# EAGLE design LSN50 v3.0 (EAGLE 9.6.2)
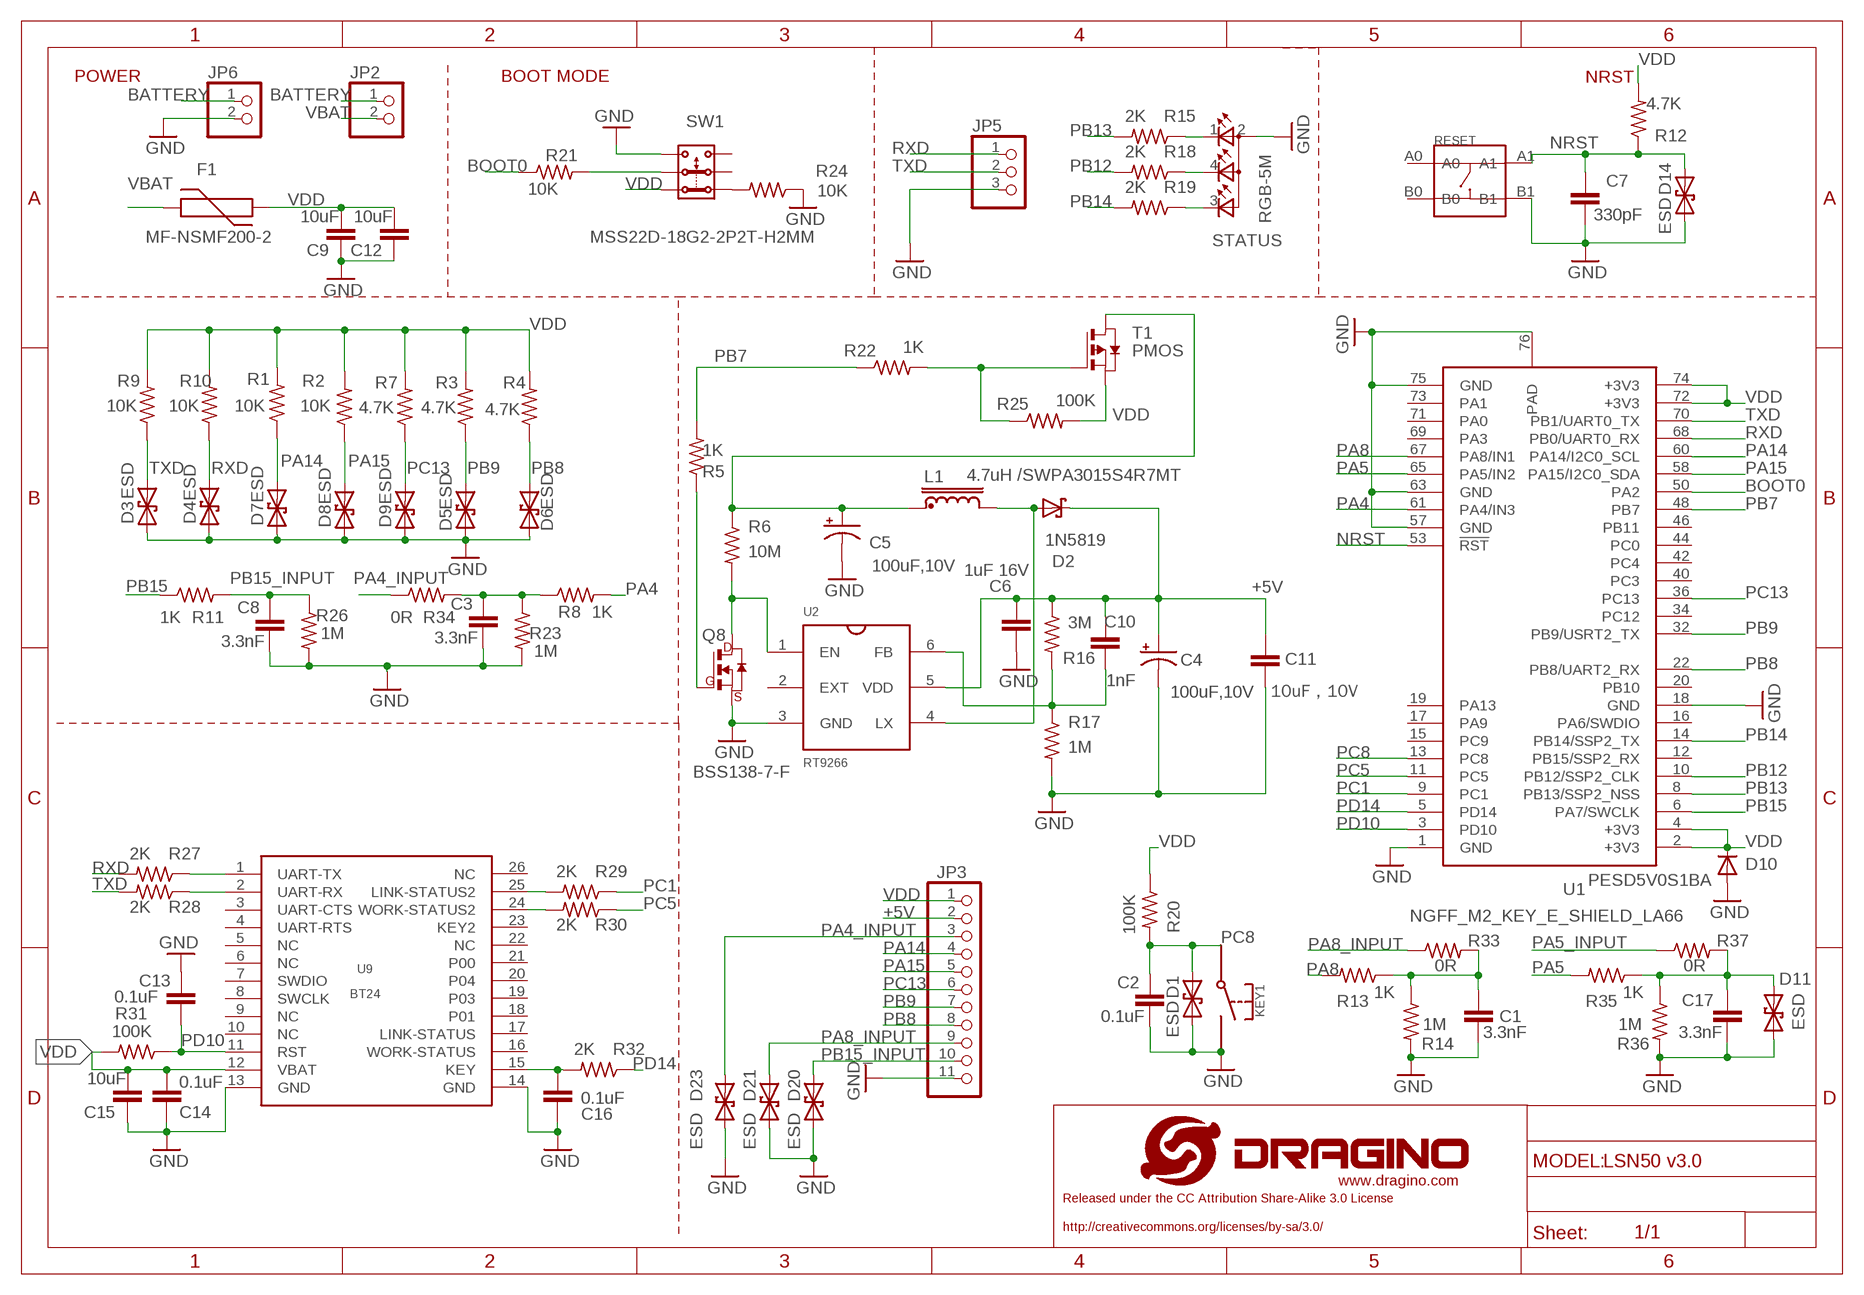
[diagram p0: schematic, sheet 1]

## Parts
C1  3.3nF  C-EUC0402  [C0402]
C2  0.1uF  C-EUC0402  [C0402]
C3  3.3nF  C-EUC0402  [C0402]
C4  100uF,10V  CPOL-USSMCB  [SMC_B]
C5  100uF,10V  CPOL-USSMCB  [SMC_B]
C6  1uF 16V  C-EUC0603  [C0603]
C7  330pF  C-EUC0402  [C0402]
C8  3.3nF  C-EUC0402  [C0402]
C9  10uF  C-EUC0805  [C0805]
C10  1nF  C-EUC0402  [C0402]
C11  10uF，10V  C-EUC0805  [C0805]
C12  10uF  C-EUC0805  [C0805]
C13  0.1uF  C-EUC0402  [C0402]
C14  0.1uF  C-EUC0402  [C0402]
C15  10uF  C-EUC0805  [C0805]
C16  0.1uF  C-EUC0402  [C0402]
C17  3.3nF  C-EUC0402  [C0402]
D1  ESD  ESD_TVS  [DFN1006]
D2  1N5819  SMF5.0AT1  [SOD123FL]
D3  ESD  ESD_TVS  [DFN1006]
D4  ESD  ESD_TVS  [DFN1006]
D5  ESD  ESD_TVS  [DFN1006]
D6  ESD  ESD_TVS  [DFN1006]
D7  ESD  ESD_TVS  [DFN1006]
D8  ESD  ESD_TVS  [DFN1006]
D9  ESD  ESD_TVS  [DFN1006]
D10  PESD5V0S1BA  DIODESOD323-R  [DIODE_SOD323-R]
D11  ESD  ESD_TVS  [DFN1006]
D14  ESD  ESD_TVS  [DFN1006]
D20  ESD  ESD_TVS  [DFN1006]
D21  ESD  ESD_TVS  [DFN1006]
D23  ESD  ESD_TVS  [DFN1006]
F1  MF-NSMF200-2  FUSE1206  [R1206]
JP2  PINHD-1X2  [1X02]
JP3  PINHD-1X11-MM  [KF350-11P]
JP5  PINHD-1X3  [1X03]
JP6  PINHD-1X2""  [XH2.54-2P]
KEY1  SWITCHDIL4  [SWITCH_6X6X19_DIL4]
L1  4.7uH /SWPA3015S4R7MT  INDUCTORSWPA3010S  [SWPA3010S]
Q8  BSS138-7-F  NMOSFET  [SOT-23]
R1  10K  R-US_R0402  [R0402]
R2  10K  R-US_R0402  [R0402]
R3  4.7K  R-US_R0402  [R0402]
R4  4.7K  R-US_R0402  [R0402]
R5  1K  R-US_R0402  [R0402]
R6  10M  R-US_R0402  [R0402]
R7  4.7K  R-US_R0402  [R0402]
R8  1K  R-US_R0402  [R0402]
R9  10K  R-US_R0402  [R0402]
R10  10K  R-US_R0402  [R0402]
R11  1K  R-US_R0402  [R0402]
R12  4.7K  R-US_R0402  [R0402]
R13  1K  R-US_R0402  [R0402]
R14  1M  R-US_R0402  [R0402]
R15  2K  R-US_R0402  [R0402]
R16  3M  R-US_R0402  [R0402]
R17  1M  R-US_R0402  [R0402]
R18  2K  R-US_R0402  [R0402]
R19  2K  R-US_R0402  [R0402]
R20  100K  R-US_R0402  [R0402]
R21  10K  R-US_R0402  [R0402]
R22  1K  R-US_R0402  [R0402]
R23  1M  R-US_R0402  [R0402]
R24  10K  R-US_R0402  [R0402]
R25  100K  R-US_R0402  [R0402]
R26  1M  R-US_R0402  [R0402]
R27  2K  R-US_R0402  [R0402]
R28  2K  R-US_R0402  [R0402]
R29  2K  R-US_R0402  [R0402]
R30  2K  R-US_R0402  [R0402]
R31  100K  R-US_R0402  [R0402]
R32  2K  R-US_R0402  [R0402]
R33  0R  R-US_R0402  [R0402]
R34  0R  R-US_R0402  [R0402]
R35  1K  R-US_R0402  [R0402]
R36  1M  R-US_R0402  [R0402]
R37  0R  R-US_R0402  [R0402]
RESET  轻触开关3*3*1.5四脚贴片开关  BUTTON-4P-3.3X3.3  [SW4-SMD-3.35X3.35X1.5MM]
STATUS  RGB-5M  [RGB]
SW1  MSS22D-18G2-2P2T-H2MM  [MSS22D-18G2-2P2T-H2MM-DIL]
T1  PMOS  PMOSSOT23  [SOT-23]
U1  NGFF_M2_KEY_E_SHIELD_LA66  [NGFF_M2_KEY_E_SHIELD]
U2  RT9266  [6/SOT-23]
U9  BT24  [BT24-SMD26]

## Nets
+5V: C4.+ C6.2 C10.2 C11.2 D2.C JP3.2 R16.1 U2.5(VDD)
BATTERY: JP2.1 JP6.1
BOOT0: R21.1 U1.50(PA2)
GND: C1.1 C2.1 C3.1 C4.- C5.- C6.1 C7.1 C8.1 C9.1 C11.1 C12.1 C13.2 C14.2 C15.1 C16.2 C17.1 D1.1 D3.1 D4.1 D5.1 D6.1 D7.1 D8.1 D9.1 D10.A D11.1 D14.1 D20.1 D21.1 D23.1 JP3.11 JP5.3 JP6.2 KEY1.2 Q8.2(S) R14.2 R17.2 R23.2 R24.1 R26.2 R36.2 RESET.B1 STATUS.2(A) SW1.1 U1.1(GND) U1.18(GND) U1.57(GND) U1.63(GND) U1.75(GND) U1.76(PAD) U2.3(GND) U9.13(GND) U9.14(GND)
N$3: R15.1 STATUS.1(CRED)
N$4: R24.2 SW1.4
N$5: Q8.3(G) R5.1
N$6: C10.1 R16.2 R17.1 U2.6(FB)
N$7: D2.A L1.P$2 U2.4(LX)
N$8: R18.1 STATUS.4(CBLUE)
N$9: Q8.1(D) R6.2 U2.1(EN)
N$10: R22.2 R25.1 T1.3(G)
N$11: R19.1 STATUS.3(CGREEN)
N$12: C1.2 R13.1 R14.1 R33.2
N$13: C5.+ L1.P$1 R6.1 T1.1(D)
N$14: R27.1 U9.1(UART-TX)
N$15: R28.1 U9.2(UART-RX)
N$16: C16.1 R32.2 U9.15(KEY)
N$17: C3.2 R8.1 R23.1 R34.2
N$18: R29.2 U9.25(LINK-STATUS2)
N$19: R30.2 U9.24(WORK-STATUS2)
N$20: C17.2 D11.2 R35.1 R36.1 R37.2
N$22: R21.2 SW1.2
NRST: C7.2 D14.2 R12.1 RESET.A1 U1.53(!RST)
PA4: R8.2 U1.61(PA4/IN3)
PA4_INPUT: D23.2 JP3.3 R34.1
PA5: R35.2 U1.65(PA5/IN2)
PA5_INPUT: R37.1
PA8: R13.2 U1.67(PA8/IN1)
PA8_INPUT: D21.2 JP3.9 R33.1
PA14: D7.2 JP3.4 R1.1 U1.60(PA14/I2C0_SCL)
PA15: D8.2 JP3.5 R2.1 U1.58(PA15/I2C0_SDA)
PB7: R5.2 R22.1 U1.48(PB7)
PB8: D6.2 JP3.8 R4.1 U1.22(PB8/UART2_RX)
PB9: D5.2 JP3.7 R3.1 U1.32(PB9/USRT2_TX)
PB12: R18.2 U1.10(PB12/SSP2_CLK)
PB13: R15.2 U1.8(PB13/SSP2_NSS)
PB14: R19.2 U1.14(PB14/SSP2_TX)
PB15: R11.1 U1.6(PA7/SWCLK)
PB15_INPUT: C8.2 D20.2 JP3.10 R11.2 R26.1
PC1: R29.1 U1.9(PC1)
PC5: R30.1 U1.11(PC5)
PC8: C2.2 D1.2 KEY1.1 R20.2 U1.13(PC8)
PC13: D9.2 JP3.6 R7.1 U1.36(PC13)
PD10: C13.1 R31.1 U1.3(PD10) U9.11(RST)
PD14: R32.1 U1.5(PD14)
RXD: D4.2 JP5.1 R10.1 R27.2 U1.68(PB0/UART0_RX)
TXD: D3.2 JP5.2 R9.1 R28.2 U1.70(PB1/UART0_TX)
VBAT: F1.2 JP2.2
VDD: C9.2 C12.2 C14.1 C15.2 D10.C F1.1 JP3.1 R1.2 R2.2 R3.2 R4.2 R7.2 R9.2 R10.2 R12.2 R20.1 R25.2 R31.2 SW1.3 T1.2(S) U1.2(+3V3) U1.4(+3V3) U1.72(+3V3) U1.74(+3V3) U9.12(VBAT)
Unconnected: RESET.A0 RESET.B0 SW1.5 SW1.6 U1.12(PB15/SSP2_RX) U1.15(PC9) U1.16(PA6/SWDIO) U1.17(PA9) U1.19(PA13) U1.20(PB10) U1.34(PC12) U1.40(PC3) U1.42(PC4) U1.44(PC0) U1.46(PB11) U1.69(PA3) U1.71(PA0) U1.73(PA1) U2.2(EXT) U9.3(UART-CTS) U9.4(UART-RTS) U9.5(NC) U9.6(NC) U9.7(SWDIO) U9.8(SWCLK) U9.9(NC) U9.10(NC) U9.16(WORK-STATUS) U9.17(LINK-STATUS) U9.18(P01) U9.19(P03) U9.20(P04) U9.21(P00) U9.22(NC) U9.23(KEY2) U9.26(NC)

## Notes on the sheet
- NRST
- POWER | BOOT MODE

## Library data of the parts
C1-C3 C6-C10 C12-C17 = dragino:C-EU: CAPACITOR, European symbol
C4 C5 = rcl:CPOL-US: POLARIZED CAPACITOR, American symbol
C11 = dragino-passive:C-EU: CAPACITOR, European symbol
D1 D3-D9 D11 D14 D20 D21 D23 = dragino:ESD_TVS: DIODE uni and bidirectional supressor diode
D2 = diode:SMF5.0AT1: 200 W Transient Voltage Suppressor Source: Data sheet <http://www.onsemi.com/pub_link/Collateral/SMF5.0AT1-D.PDF>
D10 = dragino:DIODE: DIODE
F1 = dragino:FUSE: FUSE 5 x 20 mm
JP2 JP6 = pinhead:PINHD-1X2: PIN HEADER
JP3 = pinhead:PINHD-1X11: PIN HEADER
JP5 = pinhead:PINHD-1X3: PIN HEADER
KEY1 = dragino:SWITCH
L1 = dragino:INDUCTOR: CHOKE U15
Q8 = dragino:NMOSFET: MOS FET; OC_FARNELL: unknown; OC_NEWARK: unknown
R1-R37 = dragino:R-US_: RESISTOR, American symbol
RESET = dragino:BUTTON-4P: SW4-6.0X6.0X5.0MM:311020024;SW4-8.0X8.0X9.0MM:311020028;SW4-SMD-6.0X6.0X5.0MM:311020004;SW4-SMD-3.35X3.35X1.5MM:311020030;SW4-SMD-5.2X5.2X2.5MM:311020046
STATUS = led:RGB-5M
SW1 = dragino:MSS22D-18G2-2P2T-H2MM
T1 = zetex:PMOSSOT23: MOS FET; OC_FARNELL: unknown; OC_NEWARK: unknown
U1 = dragino:NGFF_M2_KEY_E_SHIELD_LA66
U2 = dragino:RT9266
U9 = dragino:BT24

## Net classes
0 default: width 0.203 mm, drill 0.203 mm, clearance 0.203 mm
1 vcc: width 0.254 mm

## Board
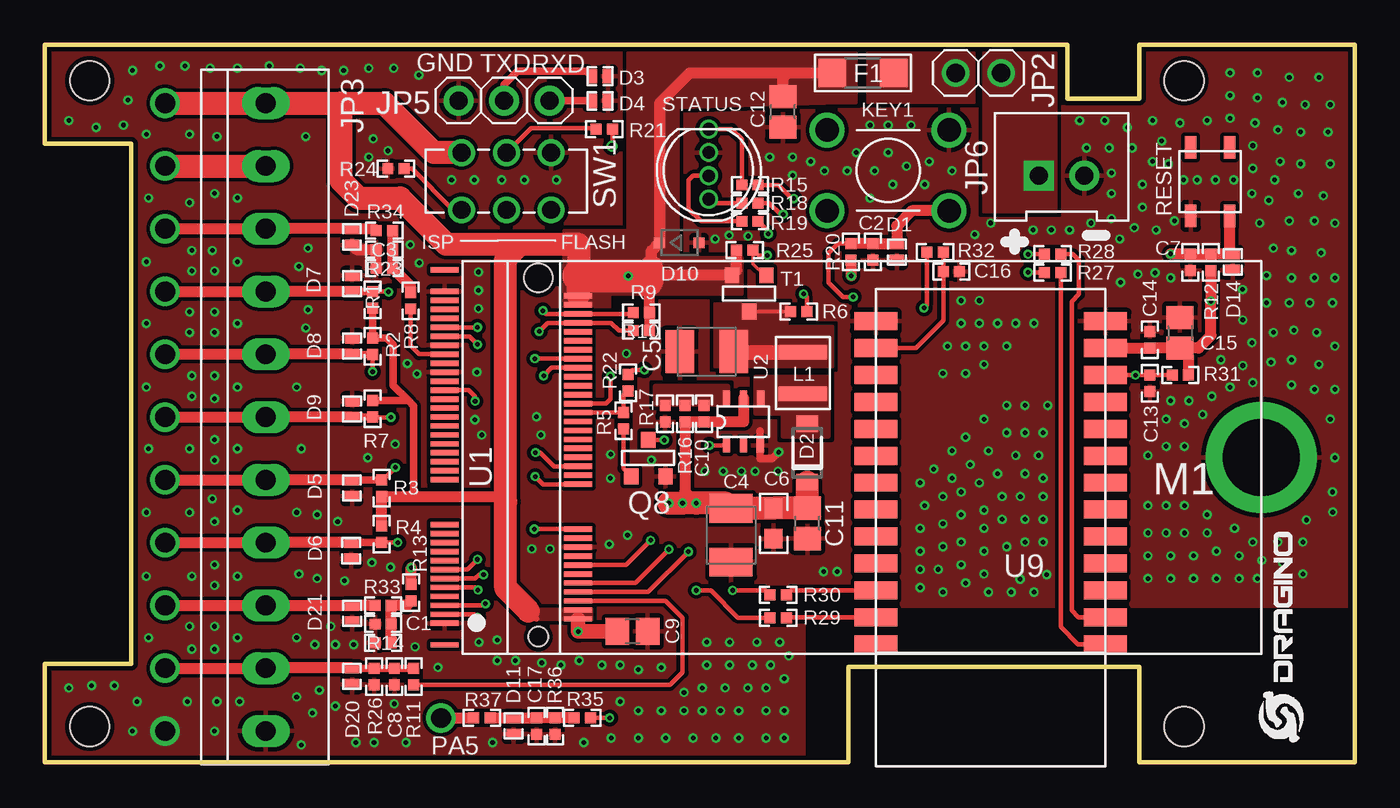
[diagram p1: board, top side]
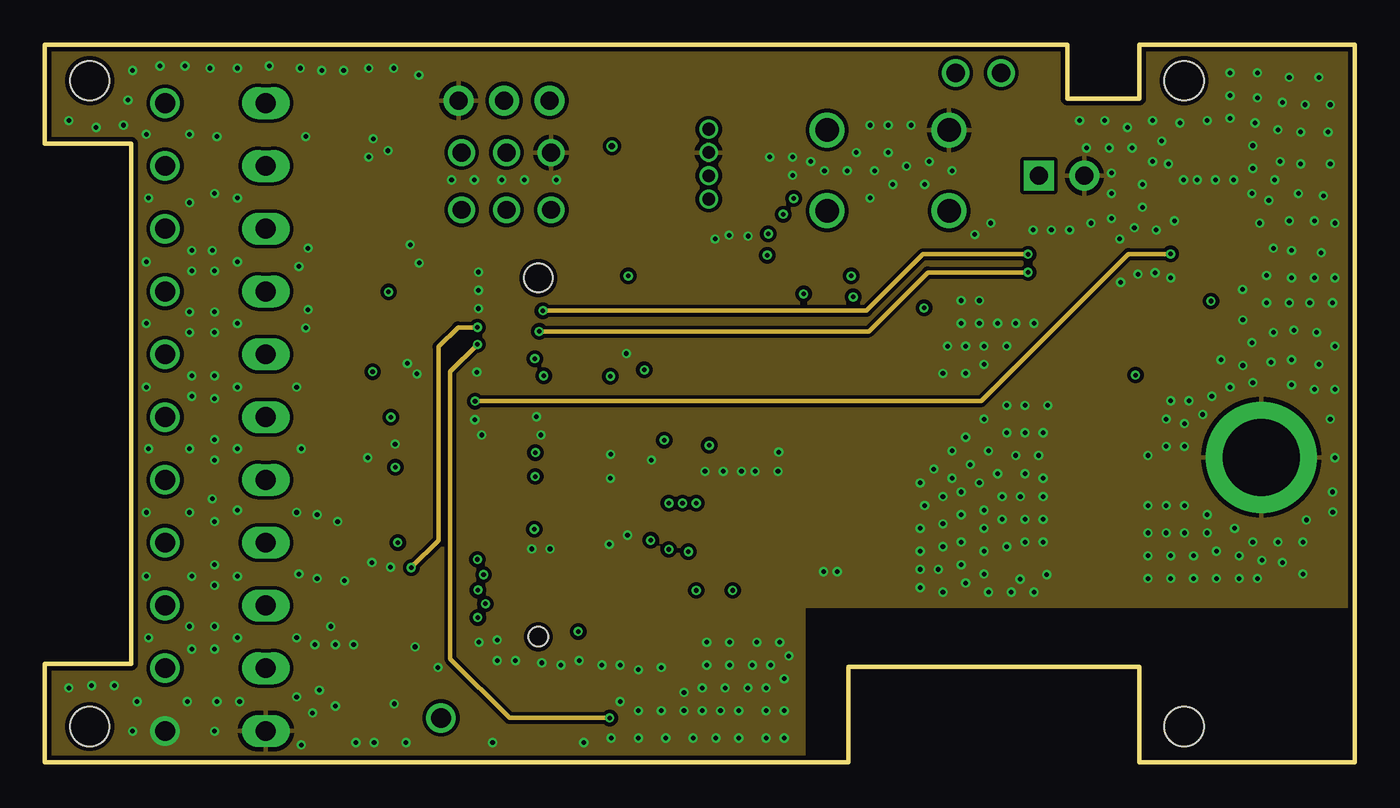
[diagram p2: board, inner layer Route2]
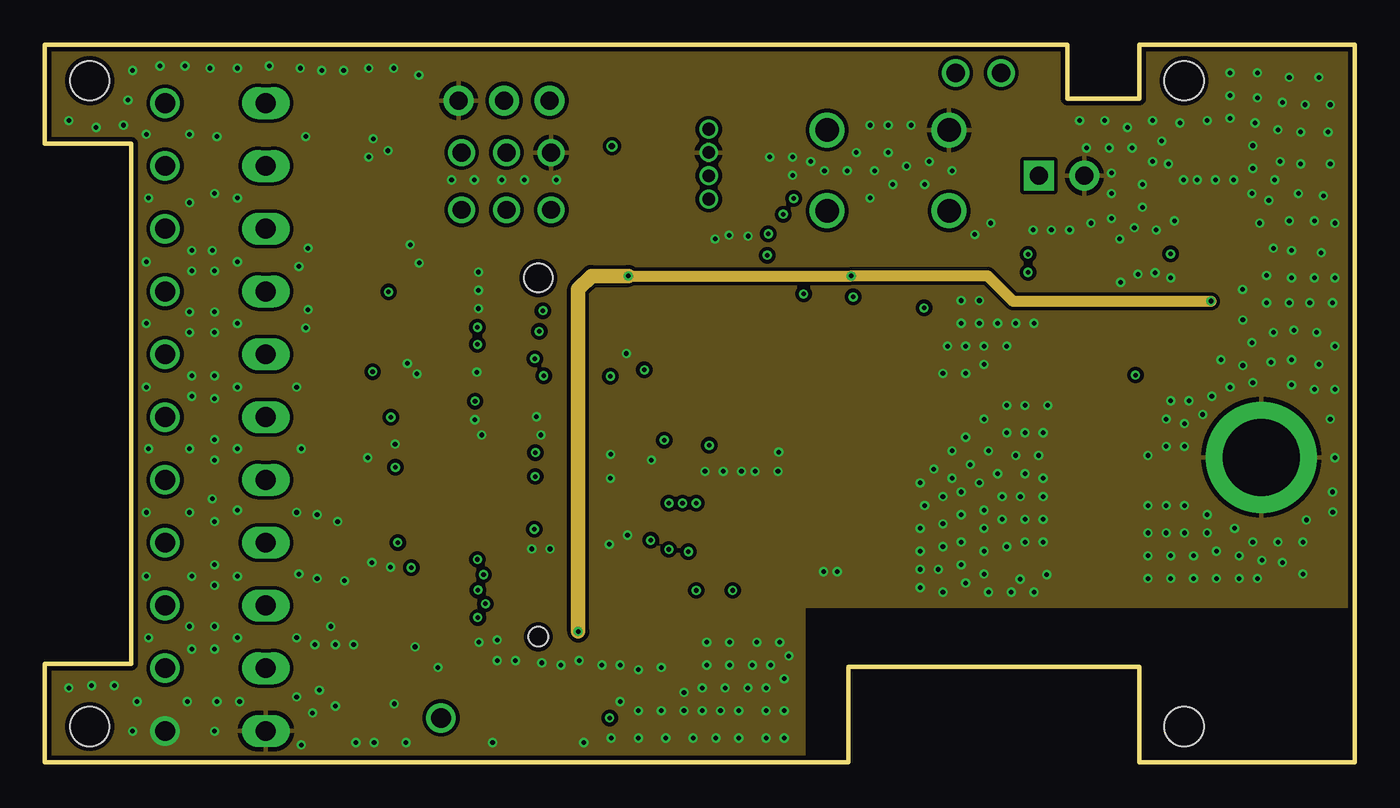
[diagram p3: board, inner layer Route15]
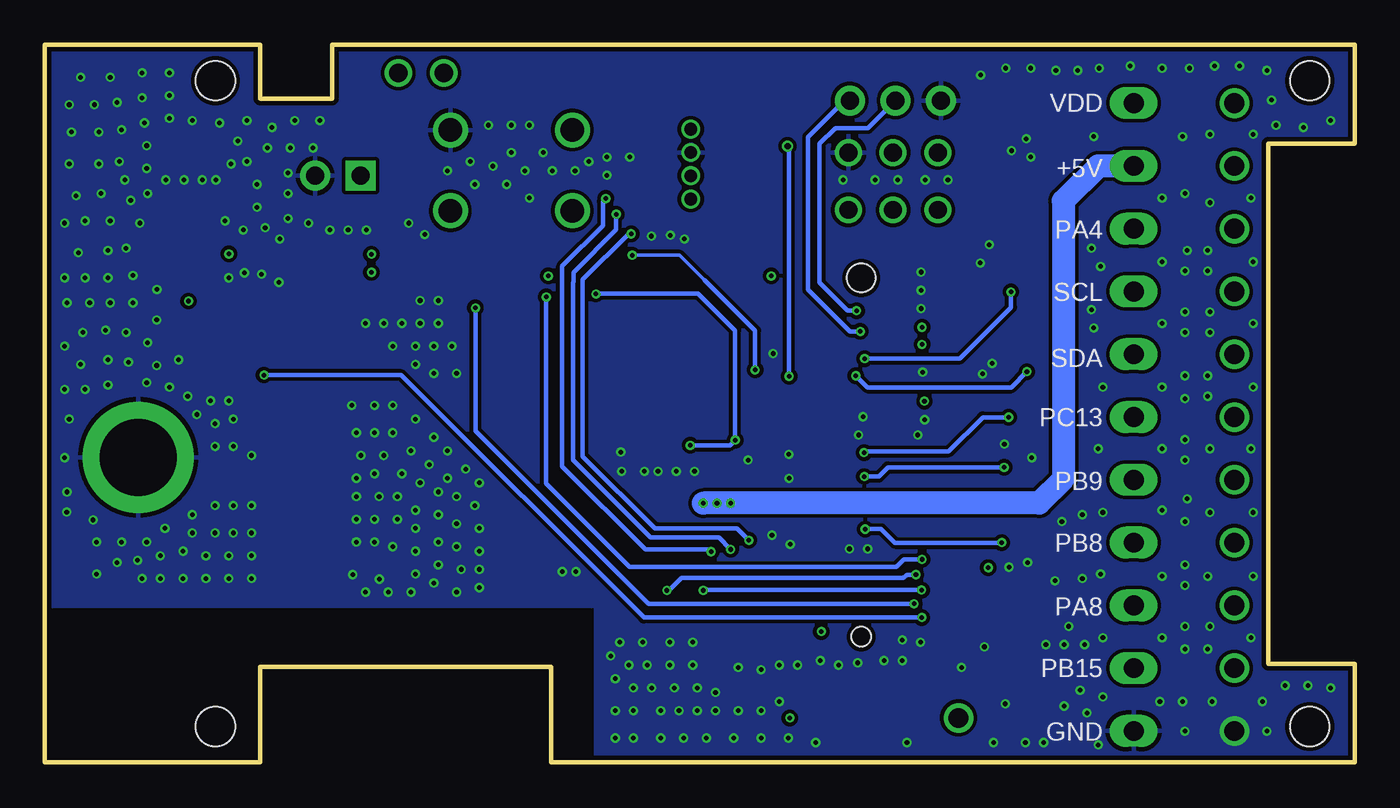
[diagram p4: board, bottom side, seen from below]

Size 73 x 40 mm. Coordinates in mm from the lower left corner, seen from the top.
Outline: 0,40 57,40 57,37 61,37 61,40 73,40 73,0 61,0 61,5.33 44.78,5.33 44.78,0 0,0 0,5.5 4.8,5.5 4.8,34.5 0,34.5 0,40
Copper layers (1*2+15*16): Top 0.035mm / dielectric 1.5mm / Route2 0.035mm / dielectric 0.15mm / Route15 0.035mm / dielectric 0.2mm / Bottom 0.035mm
Design rules "default *": minimum track width 6mil, minimum drill 10mil, track to track 8mil, track to pad 8mil, pad to pad 8mil, via to via 8mil, smd to smd 8mil, copper to edge 10mil, drill to drill 8mil, minimum pad ring 5mil, minimum via ring 5mil, stop-mask expansion 4mil, vias tented up to drill 30mil, thermal gap 10mil
Holes 2.2 mm at 2.5,2 2.5,38 63.5,38 63.5,2

### Footprints (pad centres in the part's own frame; a part is rotated, then mirrored left to right if it is on the bottom)
C0402 = smd 0.61 x 0.61: 1 -0.457,0; 2 0.457,0
SMC_B = smd 1.6 x 2.4: + -1.5,0; - 1.5,0
C0603 = smd 1.1 x 1: 1 -0.85,0; 2 0.85,0
C0805 = smd 1.3 x 1.5: 1 -0.85,0; 2 0.85,0
DFN1006 = smd 0.6 x 0.8: 1 -0.45,0; 2 0.45,0
SOD123FL = smd 0.91 x 1.22: A 1.625,0; C -1.625,0
DIODE_SOD323-R = smd 0.6 x 0.6: A 1.1,0; C -1.1,0
R1206 = smd 1.52 x 1.6: 1 -1.71,0; 2 1.71,0
1X02 = drill 1.016: 1 -1.27,0; 2 1.27,0
KF350-11P = drill 1.1 pad 1.778 long: 1 -8.75,0; 2 -5.25,0; 3 -1.75,0; 4 1.75,0; 5 5.25,0; 6 8.75,0; 7 12.25,0; 8 15.75,0; 9 19.25,0; 10 22.75,0; 11 26.25,0
1X03 = drill 1.016 pad 1.676: 1 -2.54,0; 2 0,0; 3 2.54,0
XH2.54-2P = drill 1 pad 1.676 square: 1 0,-1.27 | drill 1 pad 1.676: 2 0,1.27
SWITCH_6X6X19_DIL4 = drill 1.3: 1 -3.4,2.25; 2 -3.4,-2.25; 3 3.4,2.25; 4 3.4,-2.25
SWPA3010S = smd 0.8 x 2.7: P$1 -1.15,0; P$2 1.15,0
SOT-23 = smd 0.787 x 0.889: 1 0,-1.016; 2 -0.95,1.016; 3 0.95,1.016
R0402 = smd 0.61 x 0.61: 1 -0.457,0; 2 0.457,0
SW4-SMD-3.35X3.35X1.5MM = smd 1.27 x 0.635: A0 -1.905,1.079; A1 1.905,1.079; B0 -1.905,-1.079; B1 1.905,-1.079
RGB = drill 0.7 pad 1.016: 1 2.3,0; 2 1,0; 3 -0.3,0; 4 -1.6,0
MSS22D-18G2-2P2T-H2MM-DIL = drill 1: 1 -2.5,-1.6; 2 0,-1.6; 3 2.5,-1.6; 4 2.5,1.6; 5 0,1.6; 6 -2.5,1.6
SOT-23' = smd 0.787 x 0.889: 1 0.025,-1.016; 2 -0.94,1.016; 3 0.991,1.016
NGFF_M2_KEY_E_SHIELD = smd 0.3 x 1.55: 1 1.7,-0.775; 2 1.95,-8.225; 3 2.2,-0.775; 4 2.45,-8.225; 5 2.7,-0.775; 6 2.95,-8.225; 7 3.2,-0.775; 8 3.45,-8.225; 9 3.7,-0.775; 10 3.95,-8.225; 11 4.2,-0.775; 12 4.45,-8.225; 13 4.7,-0.775; 14 4.95,-8.225; 15 5.2,-0.775; 16 5.45,-8.225; 17 5.7,-0.775; 18 5.95,-8.225; 19 6.2,-0.775; 20 6.45,-8.225; 21 6.7,-0.775; 22 6.95,-8.225; 23 7.2,-0.775; 32 9.45,-8.225; 33 9.7,-0.775; 34 9.95,-8.225; 35 10.2,-0.775; 36 10.45,-8.225; 37 10.7,-0.775; 38 10.95,-8.225; 39 11.2,-0.775; 40 11.45,-8.225; 41 11.7,-0.775; 42 11.95,-8.225; 43 12.2,-0.775; 44 12.45,-8.225; 45 12.7,-0.775; 46 12.95,-8.225; 47 13.2,-0.775; 48 13.45,-8.225; 49 13.7,-0.775; 50 13.95,-8.225; 51 14.2,-0.775; 52 14.45,-8.225; 53 14.7,-0.775; 54 14.95,-8.225; 55 15.2,-0.775; 56 15.45,-8.225; 57 15.7,-0.775; 58 15.95,-8.225; 59 16.2,-0.775; 60 16.45,-8.225; 61 16.7,-0.775; 62 16.95,-8.225; 63 17.2,-0.775; 64 17.45,-8.225; 65 17.7,-0.775; 66 17.95,-8.225; 67 18.2,-0.775; 68 18.45,-8.225; 69 18.7,-0.775; 70 18.95,-8.225; 71 19.2,-0.775; 72 19.45,-8.225; 73 19.7,-0.775; 74 19.95,-8.225; 75 20.2,-0.775; X 0.5,-0.775; Y 21.4,-0.775 | drill 4.3 pad 6.2: 76 10.95,-46.3 | hole 1.6: 20.95,-6 | hole 1.1: 0.95,-6
6/SOT-23 = smd 0.406 x 0.813: 1 -0.965,-1.372; 2 -0.015,-1.372; 3 0.911,-1.372; 4 0.937,1.27; 5 -0.015,1.27; 6 -0.965,1.27
BT24-SMD26 = smd 2.4 x 1: 1 -6.4,6.5; 2 -6.4,5; 3 -6.4,3.5; 4 -6.4,2; 5 -6.4,0.5; 6 -6.4,-1; 7 -6.4,-2.5; 8 -6.4,-4; 9 -6.4,-5.5; 10 -6.4,-7; 11 -6.4,-8.5; 12 -6.4,-10; 13 -6.4,-11.5; 14 6.4,-11.5; 15 6.4,-10; 16 6.4,-8.5; 17 6.4,-7; 18 6.4,-5.5; 19 6.4,-4; 20 6.4,-2.5; 21 6.4,-1; 22 6.4,0.5; 23 6.4,2; 24 6.4,3.5; 25 6.4,5; 26 6.4,6.5

### Placement (x,y rotation side)
C1  18.85,7.71 0 top
C2  46.14,28.45 90 top
C3  18.92,28.6 0 top
C4  38.25,12.66 270 top
C5  36.89,22.9 180 top
C6  40.61,13.32 90 top
C7  63.84,27.88 90 top
C8  19.48,4.77 90 top
C9  32.75,7.3 180 top
C10  36.74,19.43 270 top
C11  42.49,13.32 90 top
C12  41.13,36.26 90 top
C13  61.59,21.13 270 top
C14  61.59,23.55 90 top
C15  63.27,23.94 270 top
C16  50.53,27.37 0 top
C17  27.4,2.03 90 top
D1  47.48,28.45 90 top
D2  42.49,17.25 90 top
D3  30.93,38.25 180 top
D4  30.93,36.87 180 top
D5  17.11,15.29 90 top
D6  17.08,11.8 90 top
D7  17.13,26.69 270 top
D8  17.13,23.2 270 top
D9  17.13,19.7 270 top
D10  35.36,28.97 0 top
D11  26.13,2.03 90 top
D14  66.2,27.9 90 top
D20  17.11,4.81 90 top
D21  17.12,8.3 90 top
D23  17.11,29.3 90 top
F1  45.6,38.43 0 top
JP2  52.03,38.43 180 top
JP3  12.31,28 270 top
JP5  25.59,36.89 180 top
JP6  56.67,32.7 270 top
KEY1  47,33 180 top
L1  42.25,21.71 270 top
Q8  33.63,16.97 180 top
R1  18.28,25.78 270 top
R2  18.28,23.2 90 top
R3  18.77,15.29 270 top
R4  18.78,12.71 90 top
R5  32.24,19.05 90 top
R6  42.01,25.12 0 top
R7  18.27,19.71 90 top
R8  20.38,25.74 270 top
R9  33.25,25.08 0 top
R10  33.25,24.06 0 top
R11  20.55,4.77 90 top
R12  64.99,27.88 270 top
R13  20.42,9.46 90 top
R14  18.85,6.67 180 top
R15  39.3,32.19 0 top
R16  35.67,19.43 90 top
R17  34.58,19.43 270 top
R18  39.3,31.18 0 top
R19  39.3,30.16 0 top
R20  44.94,28.45 90 top
R21  31.18,35.31 180 top
R22  32.5,21.17 90 top
R23  18.92,27.56 180 top
R24  19.57,33.09 0 top
R25  39.01,28.55 180 top
R26  18.36,4.77 270 top
R27  56.16,27.32 180 top
R28  56.16,28.33 180 top
R29  40.87,8.06 0 top
R30  40.87,9.33 0 top
R31  63.28,21.58 0 top
R32  49.61,28.46 0 top
R33  18.85,8.75 0 top
R34  18.92,29.65 0 top
R35  29.95,2.47 0 top
R36  28.43,2.03 270 top
R37  24.36,2.47 0 top
RESET  64.94,32.38 270 top
STATUS  37,33 90 top
SW1  25.72,32.4 180 top
T1  PMOS  [SOT-23']  39.23,26.14 0 top
U1  21.5,6.05 90 top
U2  38.96,19.04 0 top
U9  52.71,13.09 180 top
U$2  LOGO-NEW  [LOGO-SILK-NEW]  70.13,1.12 90 top

### Tracks (layer width: path | path; a pad name or v marks a point on that pad's centre or on a via)
+5V  (via drill 0.25, 1.1)
  Top 0.61: U2.5 38.94,18.98 C10.2 R16.1 | R16.1 | R16.1 35.67,15.08 v36.3,14.45
  Top 1.27: v6.7,33.25 JP3.2 | v34.78,14.45 v35.54,14.45 v36.3,14.45 37.96,14.45 C4.+ C6.2 C11.2 D2.C
  Bottom 1.27: JP3.2 14.29,33.25 16.24,31.3 16.24,15.81 17.59,14.45 v36.3,14.45
BATTERY
  pour Top (no thermals): 52.3,39.56 52.3,30.67 56.37,30.67 56.37,39.56
BOOT0  (via drill 0.25, 0.35)
  Top 0.254: v31.52,21.52 31.52,20.25 31.27,20 U1.50 | R21.1 31.63,34.38 v31.6,34.35
  Bottom 0.254: v31.6,34.35 31.52,34.27 v31.52,21.52
GND  (via drill 0.25, 1.1)
  Top 0.406: v40.9,17.3 40.56,16.95 39.86,16.95 39.87,16.96 U2.3 39.87,18.46 39.86,18.48
  Top 0.61: R23.2 C3.1 17.36,28.6 D23.1
  other vias: 31.52,15.84 31.54,17.17 32.41,22.79 67.27,23.39 66.77,24.66 66.77,22.12 24.35,18.25 6.7,1.75 18.3,34.76 18.05,33.74 19.13,34.1 20.84,38.32 19.45,38.7 18.05,38.7 16.65,38.57 14.24,38.7 45.99,31.46 52.72,30.06 57.67,35.78 59.07,35.78 61.74,35.78 58.05,34.25 59.32,34.25 60.59,34.25 66.75,26.37 59.45,32.86 59.45,31.71 59.45,30.32 60.72,29.81 19.52,17.74 18,16.98 58.31,30.06 61.74,33.49 62.24,34.63 60.34,35.4 63.26,35.65 62.63,33.36 64.78,35.78 66.05,35.9 66.05,37.17 66.05,38.44 67.58,38.44 67.58,37.05 67.45,35.65 67.32,34.38 67.32,33.11 69.36,38.19 71.01,38.19 68.98,36.79 70.25,36.67 71.64,36.67 68.72,35.27 69.99,35.14 71.52,35.14 68.85,33.49 69.99,33.36 71.64,33.36 68.21,31.33 69.86,31.71 71.26,31.59 67.71,30.06 69.36,30.19 70.75,30.19 71.9,30.06 68.47,28.66 69.48,28.54 71.13,28.41 68.09,27.14 69.48,27.01 70.75,27.01 71.9,27.01 68.09,25.62 69.36,25.62 70.5,25.62 71.77,25.62 68.47,23.97 69.61,24.09 70.88,23.97 71.9,23.2 68.34,22.31 69.48,22.44 71.01,22.19 69.48,21.04 70.75,20.79 71.9,20.79 71.64,19.14 68.72,12.28 70.12,12.28 68.98,11.14 71.78,13.96 70.31,13.51 71.77,15.08 71.9,16.98 21.91,5.29 17.21,6.56 16.19,6.56 20.64,6.44 16.19,3.14 15.3,4.03 14.03,3.64 14.92,2.75 14.29,0.98 10.86,3.39 9.59,3.39 7.94,3.39 9.46,1.74 5.14,3.39 4.89,1.74 3.87,4.28 1.33,4.15 9.46,6.31 9.46,7.58 8.06,7.58 8.19,6.31 10.73,6.95 14.03,6.95 15.05,6.56 15.94,7.58 9.46,9.87 9.46,11.01 8.19,10.38 10.73,10.38 14.16,10.5 15.18,10.25 16.7,10.12 18.22,11.14 25.21,6.82 24.19,6.69 5.78,6.95 5.65,10.38 5.65,13.93 8.06,13.93 9.46,13.42 9.33,14.69 10.73,14.06 14.03,13.93 15.18,13.8 16.32,13.42 9.46,16.85 9.46,18 8.06,17.49 5.78,17.49 10.73,17.49 14.29,17.49 5.65,20.92 8.19,20.41 8.19,21.55 9.46,21.55 9.46,20.28 10.73,20.92 14.03,20.92 5.65,24.47 8.06,25.11 8.06,23.96 9.46,25.11 9.46,23.96 10.73,24.47 14.67,25.23 14.54,24.22 8.19,28.54 8.19,27.39 5.65,27.9 9.33,28.54 9.46,27.39 10.73,27.9 14.67,28.66 14.16,27.65 9.46,31.71 8.06,31.2 10.73,31.46 5.78,31.46 5.65,35.01 8.06,35.01 9.59,34.89 14.54,34.89 4.38,35.52 2.86,35.39 1.33,35.77 4.63,36.92 4.89,38.57 6.41,38.82 7.81,38.82 9.21,38.7 10.73,38.7 12.51,38.82 15.43,38.57 33.08,5.17 34.35,5.29 2.6,4.28 24.17,27.33 37.35,29.17 39.19,29.34 38.14,29.39 32.07,5.42 31.05,5.42 29.78,5.68 28.76,5.42 27.7,5.55 26.22,5.68 25.21,5.68 33.08,2.88 34.35,2.88 35.62,2.88 36.64,2.88 37.65,2.88 38.67,2.88 40.19,2.88 41.21,2.88 31.56,1.36 33.08,1.36 34.61,1.36 36.13,1.36 37.4,1.36 38.67,1.36 40.19,1.36 41.21,1.36 36.64,4.15 36.89,5.42 36.89,6.69 38.16,6.69 39.69,6.69 40.96,6.69 38.16,5.42 37.91,4.15 39.18,4.15 39.43,5.42 40.45,5.42 40.19,4.15 41.21,4.66 41.46,5.93 35.62,3.9 20.36,28.86 20.87,27.84 24.17,26.32 24.17,25.3 23.97,19.1 27.4,19.27 27.65,18.25 32.48,12.66 31.46,12.15 28.16,11.9 27.14,11.9 19.27,10.88 36.79,16.22 37.81,16.22 38.83,16.22 39.59,16.22 43.4,10.63 44.16,10.63 57.11,29.68 56.1,29.68 55.08,29.68 61.18,32.22 61.18,30.95 61.94,29.68 59.91,29.17 62.96,30.19 68.54,32.47 67.27,31.71 66.26,32.47 65.24,32.47 64.23,32.47 63.46,32.47 62.75,27.01 61.88,27.29 60.92,27.22 59.96,26.76 51.07,25.74 52.08,25.74 51.07,24.47 52.08,24.47 53.1,24.47 54.12,24.47 55.13,24.47 50.31,23.2 51.32,23.2 52.34,23.2 53.61,23.2 50.05,21.68 51.32,21.68 52.34,22.19 65.55,22.44 62.75,20.16 63.77,20.16 65.04,20.41 67.32,21.17 66.05,20.92 62.5,19.14 63.51,18.89 64.53,19.39 62.5,17.62 63.51,17.62 61.48,17.11 61.48,14.31 62.5,14.31 63.51,14.31 64.78,13.81 61.48,12.79 62.5,12.79 63.51,12.79 64.78,12.79 66.31,13.04 67.32,12.28 61.48,11.52 61.48,10.25 62.75,11.52 62.75,10.25 64.02,11.52 64.02,10.25 65.29,11.77 65.29,10.25 66.56,11.52 66.56,10.25 67.58,10.25 67.83,11.27 70.12,10.5 55.89,19.9 54.62,19.9 53.61,19.9 52.34,19.14 51.32,18.12 50.56,17.36 49.54,16.35 48.78,15.58 53.61,18.38 54.62,18.38 55.64,18.38 52.59,17.36 54.12,17.11 55.39,17.11 51.58,16.6 53.1,16.09 54.62,16.09 55.64,15.84 50.56,15.84 52.08,15.58 50.05,14.82 49.04,14.31 48.78,13.04 48.78,11.77 48.78,10.76 48.78,9.74 50.05,13.3 50.05,12.03 49.8,10.76 50.05,9.49 51.32,10 51.07,11.01 51.07,12.28 51.07,13.81 51.07,15.08 52.34,14.06 52.34,13.04 52.34,11.77 52.34,10.5 52.59,9.49 53.86,9.49 55.13,9.49 55.84,10.47 54.36,10.21 53.61,12.03 54.62,12.28 55.64,12.28 55.64,13.55 55.64,14.82 54.37,14.82 53.35,14.82 53.35,13.55 54.62,13.55 40.4,33.74 41.67,33.74 42.69,33.49 41.67,32.73 43.45,32.98 44.72,32.98 45.23,34 46.24,32.98 47.26,32.22 48.02,33.24 47,34 48.27,35.52 47,35.52 45.99,35.52 49.29,33.49 49.04,32.22 50.56,32.98 51.83,29.43 40.86,16.22 30.03,1.1 32.07,3.39 24.95,1.1 20.13,1.1 18.35,1.1 17.33,1.1 19.47,3.26 23.94,32.47 25.46,32.47 22.67,32.47 26.73,32.47 28.51,32.47 33.81,16.85 24.08,21.75 20.2,22.24 20.74,21.65
  pour Top (rank 2): -1.67,40.95 73.77,40.95 73.77,8.72 42.27,8.72 42.27,-1.34 -1.67,-1.34
  pour Bottom (rank 2): -1.67,40.95 73.77,40.95 73.77,8.72 42.27,8.72 42.27,4.63 42.27,-1.34 -1.04,-1.34 -1.67,-1.34
  pour Route15 (rank 2): -1.67,40.95 73.77,40.95 73.77,8.72 42.27,8.72 42.27,4.63 42.27,-1.34 -1.04,-1.34 -1.67,-1.34
  pour Route2 (rank 2): -1.67,40.95 73.77,40.95 73.77,8.72 42.27,8.72 42.27,4.63 42.27,-1.34 -1.04,-1.34 -1.67,-1.34
N$3
  Top 0.254: STATUS.1 38.27,35.3 38.84,34.73 R15.1
N$4
  Top 0.254: R24.2 20.48,33.09 22.77,30.8 SW1.4
N$5
  Top 0.254: R5.1 32.24,16.39 Q8.3
N$6
  pour Top (no thermals): 38.08,20.97 38.08,19.95 34.02,19.95 34.02,20.97
N$7
  pour Top (no thermals): 43.67,21.48 43.67,18.18 41.13,18.18 41.13,19.45 39.6,19.45 39.6,21.48
N$8
  Top 0.254: STATUS.4 37.22,31.18 R18.1
N$9  (via drill 0.25)
  Top 0.254: U2.1 v37.03,17.67 | Q8.1 34.51,17.98 v34.52,17.97 | R6.2 42.47,25.94 v42.29,26.11
  Bottom 0.254: v37.03,17.67 34.82,17.67 v34.52,17.97 34.52,24.06 36.6,26.14 42.27,26.14 v42.29,26.11
N$10  (via drill 0.25)
  Top 0.203: T1.3 40.11,27.15 39.47,27.79 R25.1 39.75,28.27 v40.26,28.27
  Top 0.254: v33.41,21.88 32.75,21.88 R22.2
  Bottom 0.203: 36.23,26.88 37.62,28.27 v40.26,28.27
  Bottom 0.254: v33.41,21.88 33.41,24.06 36.23,26.88
N$11
  Top 0.254: STATUS.3 36.14,32.7 35.88,32.45 35.88,30.83 36.56,30.16 R19.1
N$12
  Top 0.61: R14.1 C1.2 R33.2 20.17,8.75 R13.1
N$13
  Top 0.203: R6.1 T1.1
  Top 0.813: L1.P$1 38.39,22.86 C5.+
  pour Top (no thermals): 37.32,25.59 37.32,22.03 43.92,22.03 43.92,24.32 42.14,24.32 41.38,24.32 41.38,25.33 41.38,25.59
N$14
  Top 0.254: R27.1 56.62,7.55 57.59,6.59 U9.1
N$15
  Top 0.254: U9.2 57.61,8.09 57.23,8.47 57.23,25.69 57.64,26.1 57.64,28 57.31,28.33 R28.1
N$16
  Top 0.254: U9.15 48.54,23.09 50.07,24.62 C16.1 R32.2
N$17
  Top 0.61: R34.2 C3.2 R23.1 20.38,26.55 R8.1
N$18
  Top 0.203: R29.2 41.36,8.09
  Top 0.254: 41.36,8.09 U9.25
N$19
  Top 0.254: R30.2 41.59,9.59 U9.24
N$20
  Top 0.61: R37.2 D11.2 C17.2 | C17.2 | C17.2 R36.1 28.44,2.47 R35.1
N$22
  Top 0.254: SW1.2 27.09,35.37 30.66,35.37 R21.2
NRST  (via drill 0.25)
  Top 0.254: U1.53 23.61,20.75 23.98,20.39 v23.98,20.14
  Top 0.61: D14.2 | D14.2 R12.1 C7.2 v62.74,28.34 | RESET.A1 66.02,28.51 D14.2
  Route2 0.254: v23.98,20.14 52.19,20.14 60.39,28.34 v62.74,28.34
PA4
  Top 0.254: R8.2 20.38,23.23 20.85,22.75 U1.61
PA4_INPUT  (via drill 1.1)
  Top 0.61: v6.7,29.75 JP3.3 D23.2 18.36,29.75 R34.1
PA5  (via drill 0.25)
  Top 0.254: U1.65 23.66,23.75 v24.11,23.3 | R35.2 v31.48,2.47
  Route2 0.254: v24.11,23.3 22.59,21.78 22.59,5.78 25.89,2.47 v31.48,2.47
PA5_INPUT  (via drill 1.1)
  Top 0.61: v22.08,2.47 R37.1
PA8  (via drill 0.25)
  Top 0.254: U1.67 v24.11,24.25
  Top 0.61: R13.2 v20.42,10.86
  Route2 0.254: v20.42,10.86 21.94,12.38 21.94,23.17 23.03,24.25 v24.11,24.25
PA8_INPUT  (via drill 1.1)
  Top 0.406: D21.2
  Top 0.61: R33.1 D21.2 JP3.9 v6.7,8.75
PA14  (via drill 0.25, 1.1)
  Top 0.254: R1.1 19.14,26.24 v19.16,26.22 | U1.60 v27.31,22.5 | v27.31,22.5
  Top 0.406: R1.1 D7.2
  Top 0.61: v6.7,26.25 JP3.4 D7.2
  Bottom 0.254: v27.31,22.5 27.29,22.52 22,22.52 19.16,25.36 v19.16,26.22
PA15  (via drill 0.25, 1.1)
  Top 0.254: R2.1 v18.28,21.79 v18.27,21.78 | U1.58 28.25,22 v27.8,21.55
  Top 0.406: R2.1 D8.2
  Top 0.61: v6.7,22.75 JP3.5 | D8.2 JP3.5 | JP3.5
  Bottom 0.254: v27.8,21.55 27.15,20.9 19.14,20.9 v18.27,21.78
PB7
  Top 0.254: R22.1 32.24,20.46 R5.2 U1.48
PB8  (via drill 0.25, 1.1)
  Top 0.254: v19.66,12.25 R4.1 | U1.22 v27.28,13 | v27.28,13
  Top 0.406: R4.1 D6.2
  Top 0.61: v6.7,12.25 JP3.8 D6.2
  Bottom 0.254: v27.28,13 26.39,13 25.63,12.24 19.68,12.24 v19.66,12.25
PB9  (via drill 0.25, 1.1)
  Top 0.254: R3.1 18.84,15.75 v19.54,16.44 | U1.32 27.77,15.5 v27.33,15.94
  Top 0.406: R3.1 D5.2
  Top 0.61: v6.7,15.75 JP3.7 D5.2
  Bottom 0.254: v27.33,15.94 26.52,15.94 26.02,16.44 v19.54,16.44
PB12  (via drill 0.25)
  Top 0.254: R18.2 40.37,31.18 40.99,30.55 v41.15,30.55 | U1.10 32.91,10 v34.78,11.87
  Bottom 0.254: v34.78,11.87 35.44,12.53 39.25,12.53 43.57,16.85 43.57,26.76 43.54,26.78 43.54,27.32 41.15,29.7 v41.15,30.55
PB13  (via drill 0.25)
  Top 0.254: R15.2 40.87,32.19 41.64,31.43 v41.74,31.43 | U1.8 33.63,9.5 v35.87,11.74
  Bottom 0.254: v35.87,11.74 36,11.87 39.53,11.87 44.16,16.51 44.16,27.66 41.9,29.92 41.9,31.27 v41.74,31.43
PB14  (via drill 0.25)
  Top 0.254: R19.2 40.33,29.59 v40.33,29.46 | U1.14 32.38,11 v33.76,12.38
  Bottom 0.254: v33.76,12.38 34.44,13.05 39.01,13.05 43.02,17.07 43.02,26.91 40.47,29.46 v40.33,29.46
PB15
  Top 0.254: U1.6 34.6,9 35.54,8.06 35.54,5.01 34.84,4.32 R11.1
PB15_INPUT  (via drill 1.1)
  Top 0.406: D20.2 17.14,5.23 R26.1 C8.2 R11.2
  Top 0.61: v6.7,5.25 JP3.10 D20.2
PC1  (via drill 0.25)
  Top 0.254: R29.1 38.64,8.06 37.12,9.59 v36.3,9.59 | U1.9 23.99,9.75 v24.13,9.61
  Bottom 0.254: v24.13,9.61 36.28,9.61 v36.3,9.59
PC5  (via drill 0.25)
  Top 0.254: R30.1 40.16,9.59 v38.33,9.59 | U1.11 23.99,10.25 24.2,10.46 v24.45,10.46
  Bottom 0.254: v24.45,10.46 24.96,10.46 25.15,10.27 37.52,10.27 38.21,9.59 v38.33,9.59
PC8  (via drill 0.25)
  Top 0.254: U1.13 23.55,10.75 v24.11,11.31 | R20.2 44.2,28.91 43.67,28.38 43.67,26.74 44.47,25.94 v45.05,25.94
  Top 0.61: R20.2 C2.2 46.15,28.9 D1.2 47.48,29.91 48.32,30.75 KEY1.1
  Bottom 0.254: v45.05,25.94 45.05,15.54 40.4,10.89 25.55,10.89 25.13,11.31 v24.11,11.31
PC13  (via drill 0.25, 1.1)
  Top 0.254: v19.28,19.24 18.28,19.24 R7.1 | U1.36 28.37,16.5 27.6,17.27 v27.34,17.27
  Top 0.406: R7.1 D9.2
  Top 0.61: v6.7,19.25 JP3.6 D9.2
  Bottom 0.254: v27.34,17.27 27.28,17.33 22.63,17.33 20.73,19.24 v19.28,19.24
PD10  (via drill 0.25)
  Top 0.254: C13.1 | R31.1 C13.1 | U1.3 23.95,8.25 v24.12,8.07 | U9.11 v60.79,21.59 C13.1
  Bottom 0.254: v24.12,8.07 39.62,8.07 53.13,21.59 v60.79,21.59
PD14  (via drill 0.25)
  Top 0.254: U1.5 24.47,8.75 v24.55,8.84 | R32.1 49.15,25.49 v49,25.33
  Bottom 0.254: v24.55,8.84 39.36,8.84 49,18.48 v49,25.33
RXD  (via drill 0.25)
  Top 0.254: R10.1 31.99,24.06 31.55,24.5 U1.68 28.02,24.5 v27.55,24.03 | R27.2 v54.79,27.32
  Top 0.406: JP5.1 30.46,36.89 D4.2
  Route2 0.254: v27.55,24.03 45.92,24.03 49.2,27.32 v54.79,27.32
  Bottom 0.254: JP5.1 28.43,36.89 30.46,34.86 30.46,26.35 28.14,24.03 v27.55,24.03
TXD  (via drill 0.25)
  Top 0.254: R9.1 32.72,25 U1.70 27.94,25 v27.76,25.18 | R28.2 v54.79,28.33
  Top 0.406: JP5.2 25.59,37.78 26.36,38.54 30.19,38.54 D3.2
  Route2 0.254: v27.76,25.18 45.8,25.18 48.95,28.33 v54.79,28.33
  Bottom 0.254: JP5.2 27.12,35.37 28.94,35.37 29.82,34.48 29.82,26.74 28.27,25.18 v27.76,25.18
VBAT
  pour Top (no thermals): 46.46,39.56 51.8,39.56 51.8,36.76 45.85,36.76 45.85,39.56
VDD  (via drill 0.25, 1.1)
  Top 0.305: 27.01,8.5 26.95,8.44 27.39,8
  Top 0.406: R1.2 R2.2 19.05,23.66 19.41,23.3 19.41,21.02 20.24,20.19 | 20.55,14.83 20.55,19.87 20.24,20.19 | R7.2 20.21,20.16 20.24,20.19
  Top 0.61: 33.81,27.28 33.81,27.62 33.81,28.51 D10.C 34.26,36.76 35.94,38.43 41.38,38.43 | R4.2 R3.2 20.55,14.83 25.39,14.83 25.68,14.54 | R10.2 R9.2 33.71,26.86 | F1.1 41.38,38.43 | U9.12 C14.1 C15.2 | C15.2 63.74,22.62 R31.2 | C15.2 64.29,23.09 64.99,23.8 v64.99,25.71 R12.2 | R20.1 v44.94,27.11 | R25.2 38.56,27.42 T1.2 33.37,27.15 33.33,27.11 | C12.2 41.13,38.18 41.38,38.43
  Top 0.813: 33.59,26.86 33.33,27.11 | C9.2 v29.72,7.3 U1.2
  Top 1.27: 33.81,27.62 33.81,27.11 | 33.81,27.11 33.81,26.86 | 33.81,26.86 33.81,26.81 | 26.95,8.44 25.68,9.71 25.68,14.54 25.68,28.08 26.49,28.89 | 29.74,26.02 29.74,27.11 29.74,28.89 26.49,28.89 | 33.59,26.86 33.71,26.86 33.81,26.86 | 33.8,27.12 33.81,27.11 | v6.7,36.75 JP3.1 16.49,36.75 | 16.49,36.75 18.92,36.75 21.67,34 SW1.3 | 16.49,36.75 16.49,32.45 17.48,31.45 19.8,31.45 22.37,28.89 26.49,28.89
  Top 1.778: 29.74,27.11 33.33,27.11 | 33.58,26.87 33.59,26.86
  Route15 0.61: v64.99,25.71 53.95,25.71 52.56,27.11 v44.94,27.11 v32.52,27.11
  Route15 0.813: v29.72,7.3 29.72,26.38 30.46,27.11 v32.52,27.11
  pour Top (no thermals): 26.95,8.57 30.51,8.57 30.51,7.94 26.95,7.94
  pour Top (no thermals): 45.19,39.56 32.49,39.56 32.49,29.65 28.94,29.65 28.94,25.33 31.48,25.33 31.48,26.1 38.84,26.1 38.84,28.13 35.29,28.13 35.29,36.51 44.43,36.76 45.19,36.76

### Text on the board
tPlace: GND | TXD | RXD | ISP | FLASH | M1 | PA5
bPlace: VDD | +5V | PA4 | SCL | SDA | PC13 | PB9 | PB8 | PA8 | PB15 | GND
tDocu: LSN50 v3.0